# Altium schematic sheet adc_dac_codec.SchDoc: mcHF Pro Transceiver UI board
size A3; Author: Krassi Atanassov; CompanyName: MØNKA; Engineer: For radio amateurs experimentation, non-commercial use only. Thank you!; Revision: 0.8.2; SheetTotal: 18
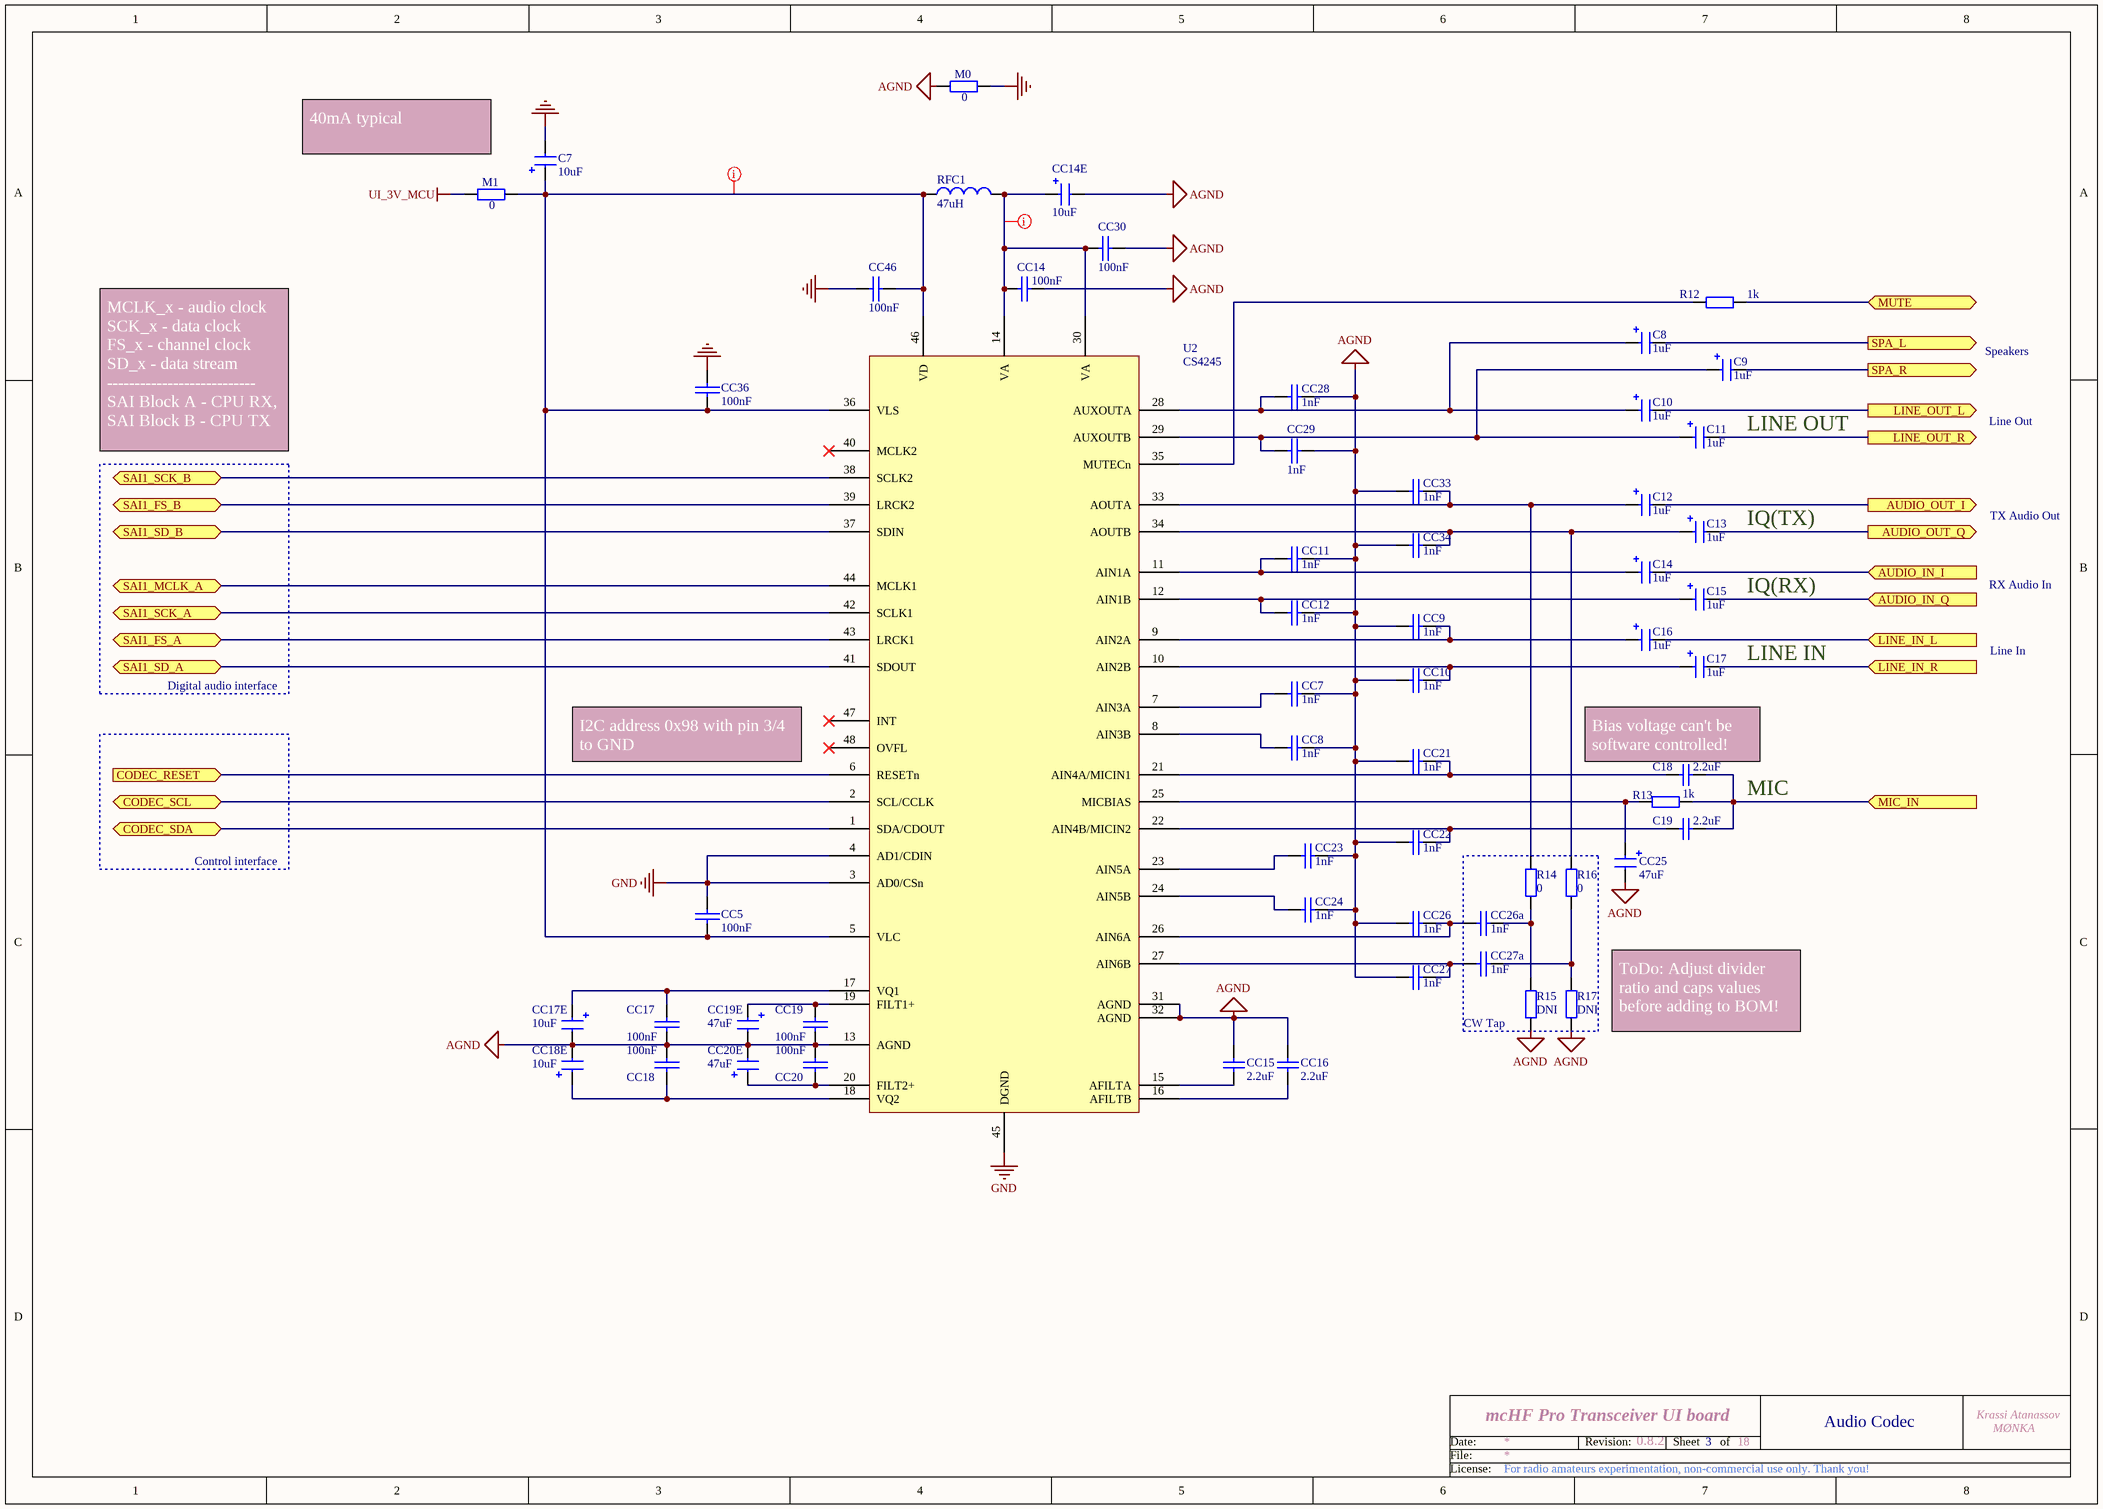
[diagram p0: adc_dac_codec.SchDoc]

## Parts
C7  10uF  [1206_Elec_Cap]
C8  1uF  [1206_Elec_Cap]
C9  1uF  [1206_Elec_Cap]
C10  1uF  [1206_Elec_Cap]
C11  1uF  [1206_Elec_Cap]
C12  1uF  [1206_Elec_Cap]
C13  1uF  [1206_Elec_Cap]
C14  1uF  [1206_Elec_Cap]
C15  1uF  [1206_Elec_Cap]
C16  1uF  [1206_Elec_Cap]
C17  1uF  [1206_Elec_Cap]
C18  2.2uF  [0805]
C19  2.2uF  [0805]
CC5  100nF  [0805]
CC7  1nF  [0805]
CC8  1nF  [0805]
CC9  1nF  [0805]
CC10  1nF  [0805]
CC11  1nF  [0805]
CC12  1nF  [0805]
CC14  100nF  [0805]
CC14E  10uF  [1206_Elec_Cap]
CC15  2.2uF  [0805]
CC16  2.2uF  [0805]
CC17  100nF  [0805]
CC17E  10uF  [1206_Elec_Cap]
CC18  100nF  [0805]
CC18E  10uF  [1206_Elec_Cap]
CC19  100nF  [0805]
CC19E  47uF  [1206_Elec_Cap]
CC20  100nF  [0805]
CC20E  47uF  [1206_Elec_Cap]
CC21  1nF  [0805]
CC22  1nF  [0805]
CC23  1nF  [0805]
CC24  1nF  [0805]
CC25  47uF  [1206_Elec_Cap]
CC26  1nF  [0805]
CC26a  1nF  [0805]
CC27  1nF  [0805]
CC27a  1nF  [0805]
CC28  1nF  [0805]
CC29  1nF  [0805]
CC30  100nF  [0805]
CC33  1nF  [0805]
CC34  1nF  [0805]
CC36  100nF  [0805]
CC46  100nF  [0805]
M0  0  [0805]
M1  0  [0805]
R12  1k  [0805]
R13  1k  [0805]
R14  0  [0805]
R15  DNI  [0805]  (no BOM)
R16  0  [0805]
R17  DNI  [0805]  (no BOM)
RFC1  47uH  [0805]
U2  CS4245  [QUAD48]

## Blocks framed on the sheet
CW Tap: CC26a CC27a R14-R17

## Ports
AUDIO_IN_I (in), AUDIO_IN_Q (in), AUDIO_OUT_I (out), AUDIO_OUT_Q (out), CODEC_RESET (in), CODEC_SCL (bidir), CODEC_SDA (bidir), LINE_IN_L (in), LINE_IN_R (in), LINE_OUT_L (out), LINE_OUT_R (out), MIC_IN (in), MUTE (bidir), SAI1_FS_A (bidir), SAI1_FS_B (bidir), SAI1_MCLK_A (bidir), SAI1_SCK_A (bidir), SAI1_SCK_B (bidir), SAI1_SD_A (bidir), SAI1_SD_B (bidir), SPA_L (out), SPA_R (out)

## Nets
AGND: CC7.1 CC8.1 CC9.2 CC10.2 CC11.1 CC12.1 CC14.1 CC14E.2 CC15.1 CC16.1 CC17.1 CC17E.2 CC18.2 CC18E.2 CC19.1 CC19E.2 CC20.2 CC20E.2 CC21.2 CC22.2 CC23.1 CC24.1 CC25.2 CC26.2 CC27.2 CC28.1 CC29.1 CC30.1 CC33.2 CC34.2 M0.2 R15.2 R17.2 U2.13(AGND) U2.31(AGND) U2.32(AGND)
GND: C7.2 CC5.2 CC36.2 CC46.2 M0.1 U2.3(AD0/CSn) U2.4(AD1/CDIN) U2.45(DGND)
UI_3V_MCU: M1.2
AUDIO_IN_I: C14.2 ; port AUDIO_IN_I
AUDIO_IN_Q: C15.2 ; port AUDIO_IN_Q
AUDIO_OUT_I: C12.2 ; port AUDIO_OUT_I
AUDIO_OUT_Q: C13.2 ; port AUDIO_OUT_Q
CODEC_RESET: U2.6(RESETn) ; port CODEC_RESET
CODEC_SCL: U2.2(SCL/CCLK) ; port CODEC_SCL
CODEC_SDA: U2.1(SDA/CDOUT) ; port CODEC_SDA
LINE_IN_L: C16.2 ; port LINE_IN_L
LINE_IN_R: C17.2 ; port LINE_IN_R
LINE_OUT_L: C10.2 ; port LINE_OUT_L
LINE_OUT_R: C11.2 ; port LINE_OUT_R
MIC_IN: C18.2 C19.2 R13.1 ; port MIC_IN
MUTE: R12.1 ; port MUTE
SAI1_FS_A: U2.43(LRCK1) ; port SAI1_FS_A
SAI1_FS_B: U2.39(LRCK2) ; port SAI1_FS_B
SAI1_MCLK_A: U2.44(MCLK1) ; port SAI1_MCLK_A
SAI1_SCK_A: U2.42(SCLK1) ; port SAI1_SCK_A
SAI1_SCK_B: U2.38(SCLK2) ; port SAI1_SCK_B
SAI1_SD_A: U2.41(SDOUT) ; port SAI1_SD_A
SAI1_SD_B: U2.37(SDIN) ; port SAI1_SD_B
SPA_L: C8.2 ; port SPA_L
SPA_R: C9.2 ; port SPA_R
NetC7_1: C7.1 CC5.1 CC36.1 CC46.1 M1.1 RFC1.1 U2.5(VLC) U2.36(VLS) U2.46(VD)
NetC8_1: C8.1 C10.1 CC28.2 U2.28(AUXOUTA)
NetC9_1: C9.1 C11.1 CC29.2 U2.29(AUXOUTB)
NetC12_1: C12.1 CC33.1 R14.1 U2.33(AOUTA)
NetC13_1: C13.1 CC34.1 R16.1 U2.34(AOUTB)
NetC14_1: C14.1 CC11.2 U2.11(AIN1A)
NetC15_1: C15.1 CC12.2 U2.12(AIN1B)
NetC16_1: C16.1 CC9.1 U2.9(AIN2A)
NetC17_1: C17.1 CC10.1 U2.10(AIN2B)
NetC18_1: C18.1 CC21.1 U2.21(AIN4A/MICIN1)
NetC19_1: C19.1 CC22.1 U2.22(AIN4B/MICIN2)
NetCC7_2: CC7.2 U2.7(AIN3A)
NetCC8_2: CC8.2 U2.8(AIN3B)
NetCC14_2: CC14.2 CC14E.1 CC30.2 RFC1.2 U2.14(VA) U2.30(VA)
NetCC15_2: CC15.2 U2.15(AFILTA)
NetCC16_2: CC16.2 U2.16(AFILTB)
NetCC17_2: CC17.2 CC17E.1 U2.17(VQ1)
NetCC18_1: CC18.1 CC18E.1 U2.18(VQ2)
NetCC19_2: CC19.2 CC19E.1 U2.19(FILT1+)
NetCC20_1: CC20.1 CC20E.1 U2.20(FILT2+)
NetCC23_2: CC23.2 U2.23(AIN5A)
NetCC24_2: CC24.2 U2.24(AIN5B)
NetCC25_1: CC25.1 R13.2 U2.25(MICBIAS)
NetCC26_1: CC26.1 CC26a.2 U2.26(AIN6A)
NetCC26a_1: CC26a.1 R14.2 R15.1
NetCC27_1: CC27.1 CC27a.2 U2.27(AIN6B)
NetCC27a_1: CC27a.1 R16.2 R17.1
NetR12_2: R12.2 U2.35(MUTECn)

Not connected (* = marked no-connect by the designer): U2 40(MCLK2)* 47(INT)* 48(OVFL)*

## Layout directives
rule Width Constraint [Pref Width = 12mil    Min Width = 12mil    Max Width = 12mil]: NetC7_1, NetCC14_2

## Notes on the sheet
- 40mA typical
- Speakers
- MCLK_x - audio clock     SCK_x - data clock       FS_x - channel clock       SD_x - data stream         ---------------------------    SAI Block A - CPU RX, SAI Block B - CPU TX
- LINE OUT
- Line Out
- TX Audio Out
- (near C13) IQ(TX)
- RX Audio In
- IQ(RX)
- Line In
- Digital audio interface
- LINE IN
- I2C address 0x98 with pin 3/4 to GND
- (near C18) Bias voltage can't be software controlled!
- MIC
- Control interface
- (near R17) ToDo: Adjust divider ratio and caps values before adding to BOM!
- 3
- Audio Codec
- Date:
- File:
- Revision:
- Sheet
- of
- License:

## Library data of the parts
C7 CC17E CC18E = CAP-POL: Electrolitic capacitor; Order: FN 233-3009; QT Order: QCC-00166; Price: 0.204
C8 = CAP-POL: Electrolitic capacitor; Order: FN 145-7406; QT Order: QCC-00165; Notes: Tantalum capacitor; Price: 0.235
C9-C17 = CAP-POL: Electrolitic capacitor; Order: FN 145-7406; QT Order: QCC-00165; Price: 0.235
C18 C19 CC15 = CAP: Capacitor; Value: 100nF; Published: 8-Jun-2000; Revision: July-2002: Re-released for DXP Platform.; Publisher: Altium Limited
CC5 CC14 CC17-CC20 CC30 CC36 CC46 = CAP: Capacitor; Order: FN 252-2090; QT Order: QCC-00154; Price: 0.068
CC7-CC12 CC21-CC24 CC26 CC26a CC27 CC27a CC28 CC29 CC33 CC34 = CAP: Capacitor
CC14E = CAP-POL: Electrolitic capacitor; Order: FN 233-3009; QT Order: QCC-00166; Notes: Tantalum capacitor; Price: 0.204
CC16 = CAP: Capacitor; Value: 100nF; Notes: Ceramic Capacitor, low ESR; Published: 8-Jun-2000; Revision: July-2002: Re-released for DXP Platform.; Publisher: Altium Limited
CC19E CC25 = CAP-POL: Electrolitic capacitor; Notes: Tantalum Capacitor; Price: 0.204
CC20E = CAP-POL: Electrolitic capacitor; Price: 0.204
M0 M1 = RES: Resistor; Order: FN 933-3681; QT Order: QCR-00268; Price: 0.009
R12 R13 = RES: Resistor; Order: FN 933-2421; QT Order: QCR-00279; Price: 0.013
R14-R17 = RES: Resistor; Price: 0.013
RFC1 = Inductor: Order: FN 166-9895; Price: 0.16
U2 = CS4245: Audio CODEC